# EAGLE design FD Capacitance Sensor v09 (EAGLE 9.5.2)
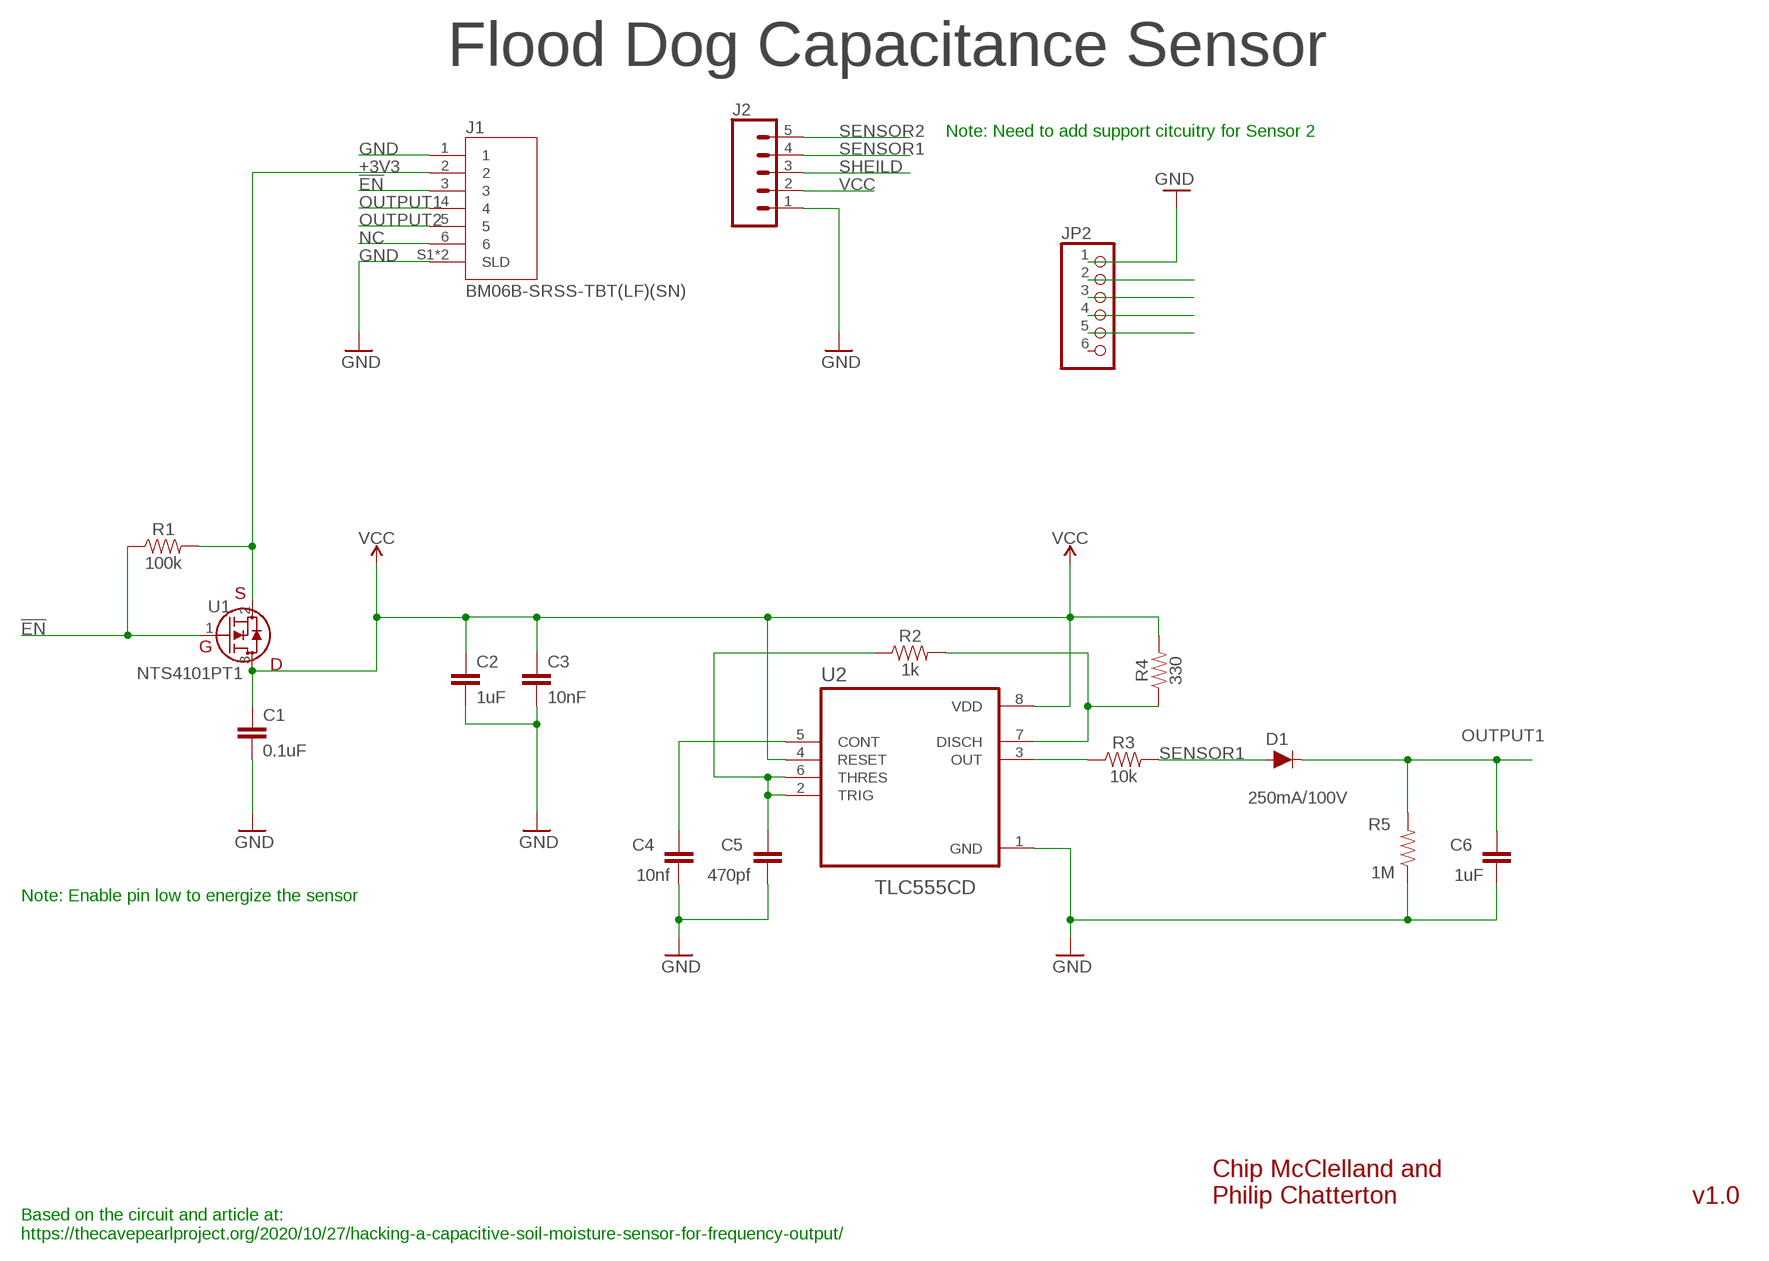
[diagram p0: schematic, sheet 1]

## Parts
C1  0.1uF  CAP-MF-0.1UF-0805  [0805@1]
C2  1uF  CAP-MF-1UF-0805  [0805@1]
C3  10nF  CAP-10NF-0805  [0805@1]
C4  10nf  C-EUC0805  [C0805]
C5  470pf  C-EUC0805  [C0805]
C6  1uF  C-EUC0805  [C0805]
D1  250mA/100V  DIODE-BAS16J  [SOD-323]
J1  BM06B-SRSS-TBT(LF)(SN)  [JST_BM06B-SRSS-TB(LF)(SN)]
J2  CONN_05SCREW  [SCREWTERMINAL-3.5MM-5]
JP2  PINHD-1X6B  [1X06-BIG]
R1  100k  RESISTOR-MF-100K-0805  [0805]
R2  1k  RESISTOR-MF-1K-0805  [0805]
R3  10k  RESISTOR-MF-10K-0805  [0805]
R4  330  RESISTOR-MF-330-0805  [0805]
R5  1M  RESISTOR-MF-1K-0805  [0805]
U1  NTS4101PT1  [SOT_101PT1_ONS]
U2  TLC555CD  [SOIC127P599X175-8N]

## Nets
!EN: J1.3 R1.1 U1.1(G)
+3V3: J1.2 R1.2 U1.2(S)
GND: C1.2 C2.2 C3.2 C4.1 C5.1 C6.1 J1.1 J1.S1(SLD) J1.S2(SLD) J2.1 JP2.1 R5.1 U2.1(GND)
N$1: C4.2 U2.5(CONT)
N$2: JP2.3
N$3: JP2.2
N$4: JP2.4
N$5: R3.1 U2.3(OUT)
N$6: JP2.5
N$8: C5.2 R2.1 U2.2(TRIG) U2.6(THRES)
N$9: R2.2 R4.1 U2.7(DISCH)
NC: J1.6
OUTPUT1: C6.2 D1.C J1.4 R5.2
OUTPUT2: J1.5
SENSOR1: D1.A J2.4 R3.2
SENSOR2: J2.5
SHEILD: J2.3
VCC [VCC]: C1.1 C2.1 C3.1 J2.2 R4.2 U1.3(D) U2.4(RESET) U2.8(VDD)
Unconnected: JP2.6

## Notes on the sheet
- Flood Dog Capacitance Sensor
- Note: Need to add support citcuitry for Sensor 2
- Note: Enable pin low to energize the sensor
- Chip McClelland and
  Philip Chatterton
- v1.0
- Based on the circuit and article at:
  https://thecavepearlproject.org/2020/10/27/hacking-a-capacitive-soil-moisture-sensor-for-frequency-output/

## Library data of the parts
C1 = Custom Components:CAP-MF-0.1UF-: Capacitor Macrofab House Part (https://factory.macrofab.com/parts). Standard ceramic capacitor, and 0.1" leaded capacitor.; HOUSEPART: YES; MPN: MF-CAP-0805-0.1uF; POPULATE: 1; URL: https://factory.macrofab.com/part/MF-CAP-0805-0.1uF
C2 = Custom Components:CAP-MF-1UF-: Capacitor Macrofab House Part (https://factory.macrofab.com/parts). Standard ceramic capacitor, and 0.1" leaded capacitor.; HOUSEPART: yes; MPN: MF-CAP-0805-1uF; POPULATE: 1; URL: https://factory.macrofab.com/part/MF-CAP-0805-1uF
C3 = Custom Components:CAP-10NF-: Capacitor 10nF variant Standard 0805 ceramic capacitor; DIGIKEY: 399-C0805X103K1RAC3316CT-ND; HOUSEPART: NO; MPN: C0805X103K1RAC3316; POPULATE: 1; URL: https://www.digikey.com/en/products/detail/kemet/C0805X103K1RAC3316/10315780
C4-C6 = rcl:C-EU: CAPACITOR, European symbol; SPICEPREFIX: C
D1 = Custom Components:DIODE: Diode These are standard reverse protection diodes and small signal diodes. SparkFun Products: SparkFun SparkPunk Sound Kit <https://www.sparkfun.com/products/11177> SparkFun ESP8266 Thing <https://www.sparkfun.com/products/13231>; MPN: BAS16HT1G
J1 = Custom Components:BM06B-SRSS-TBT(LF)(SN): 6 Position 1.0mm Top-Entry Surface Mount Shrouded Header; MPN: BM06B-SRSS-TBT(LF)(SN); POPULATE: 1
J2 = SparkFun-Connectors:CONN_05: Multi connection point. Often used as Generic Header-pin footprint for 0.1 inch spaced/style header connections On any of the 0.1 inch spaced packages, you can populate with these: Break Away Headers - Straight <https://www.sparkfun.com/products/116> (PRT-00116) Break Away Male Headers - Right Angle <https://www.sparkfun.com/products/553> (PRT-00553) Female Headers <https://www.sparkfun.com/products/115> (PRT-00115) Break Away Headers - Machine Pin <https://www.sparkfun.com/products/117> (PRT-00117) Break Away Female Headers - Swiss Machine Pin <https://www.sparkfun.com/products/743> (PRT-00743) For SCREWTERMINALS and SPRING TERMINALS visit here: Screw Terimnals on SparkFun.com <https://www.sparkfun.com/search/results?term=Screw+Terminals> (5mm/3.5mm/2.54mm spacing) This device is also useful as a general connection point to wire up your design to another part of your project. Our various solder wires solder well into these plated through hole pads. Hook-Up Wire - Assortment (Stranded, 22 AWG) <https://www.sparkfun.com/products/11375> (PRT-11375) Hook-Up Wire - Assortment (Solid Core, 22 AWG) <https://www.sparkfun.com/products/11367> (PRT-11367) View the entire wire category on our website here <https://www.sparkfun.com/categories/141> Special notes: Molex polarized connector foot print use with SKU : PRT-08231 with associated crimp pins and housings. 1MM SMD Version SKU: PRT-10208; PROD_ID: Combine 8288+8399
JP2 = adafruit:PINHD-1X6: PIN HEADER
R1 = Custom Components:RESISTOR-MF-100K-: Generic 0805 Resistor Package; MPN: MF-RES-0805-100K; POPULATE: 1; URL: https://factory.macrofab.com/part/MF-RES-0805-100K
R2 = Custom Components:RESISTOR-MF-1K-: Generic 0805 Resistor Package; HOUSEPART: YES; MPN: MF-RES-0805-1K; POPULATE: 1; URL: https://factory.macrofab.com/part/MF-RES-0805-1k
R3 = Custom Components:RESISTOR-MF-10K-: Generic 0805 Resistor Package; MPN: MF-RES-0805-10K; POPULATE: 1; URL: https://factory.macrofab.com/part/MF-RES-0805-10K
R4 = Custom Components:RESISTOR-MF-330-: Generic 0805 Resistor Package; HOUSEPART: YES; MPN: MF-RES-0805-330; POPULATE: 1
R5 = Custom Components:RESISTOR-MF-1K-: Generic 0805 Resistor Package; HOUSEPART: YES; MPN: MF-RES-0805-1K; POPULATE: 1; URL: https://factory.macrofab.com/part/MF-RES-0805-1k; VALUE: 1k
U1 = Custom Components:NTS4101PT1; DATASHEET: https://datasheet.octopart.com/NTS4101PT1-ON-Semiconductor-datasheet-139013286.pdf; MANUFACTURER_PART_NUMBER: NTS4101PT1; SOURCELIBRARY: ON_Semiconductor_2020-03-06; VENDOR: ON Semiconductor
U2 = Custom Components:TLC555CD; DESCRIPTION: 2.1-MHz, 250-A, Low-Power Timer 8-SOIC 0 to 70; DIGI-KEY_PART_NUMBER: 296-52992-ND; MF: Texas Instruments; MP: TLC555CD; PACKAGE: SOIC-8 Texas Instruments; PURCHASE-URL: https://pricing.snapeda.com/search/part/TLC555CD/?ref=eda

## Board
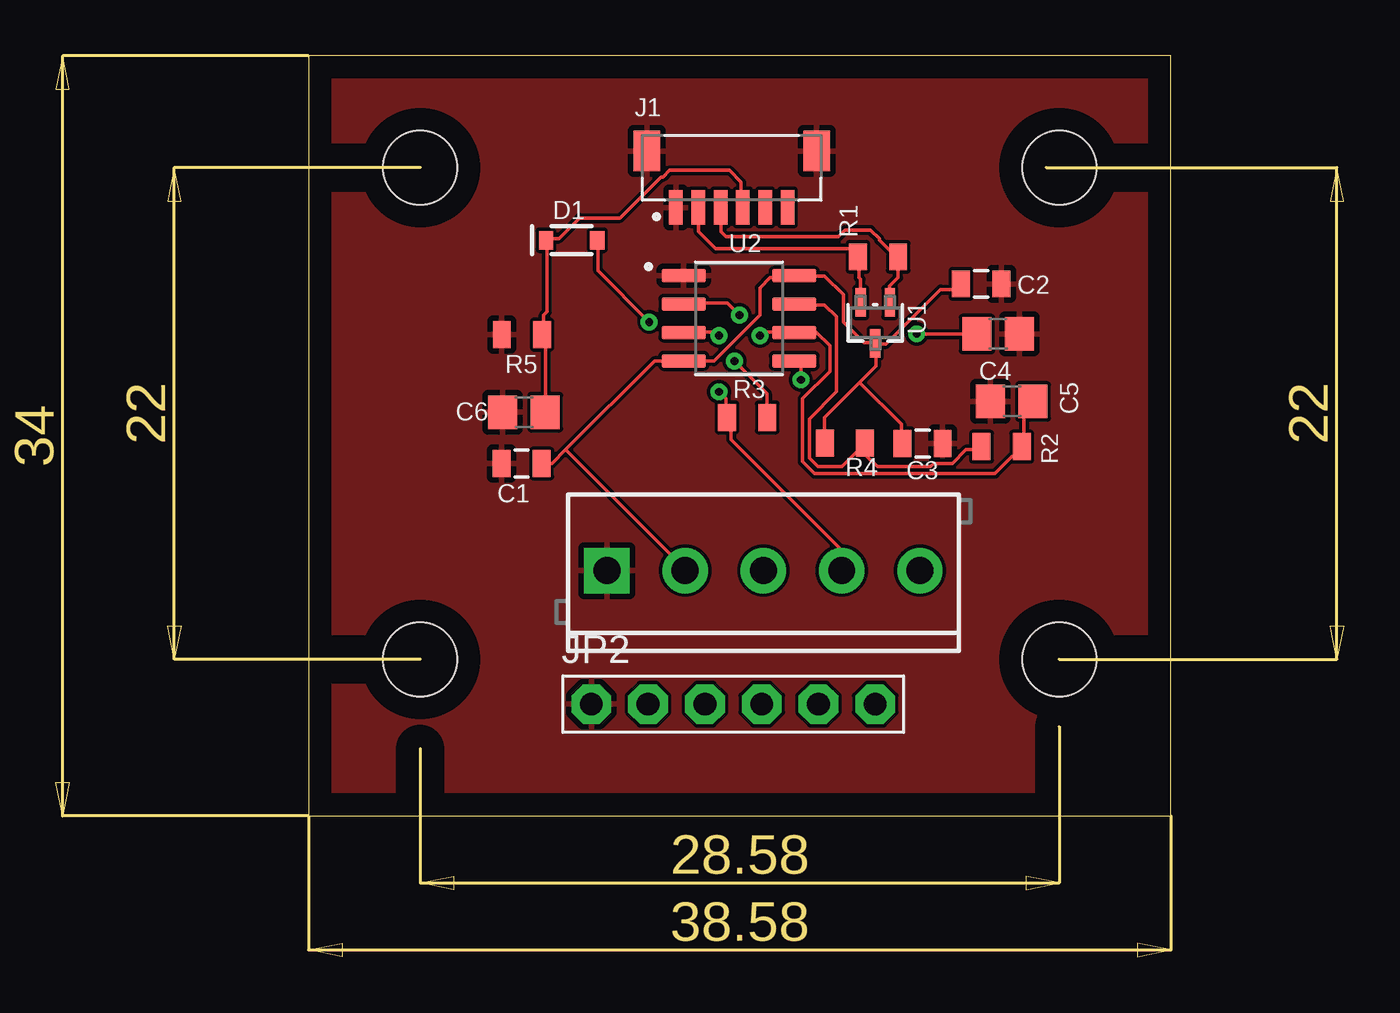
[diagram p1: board, top side]
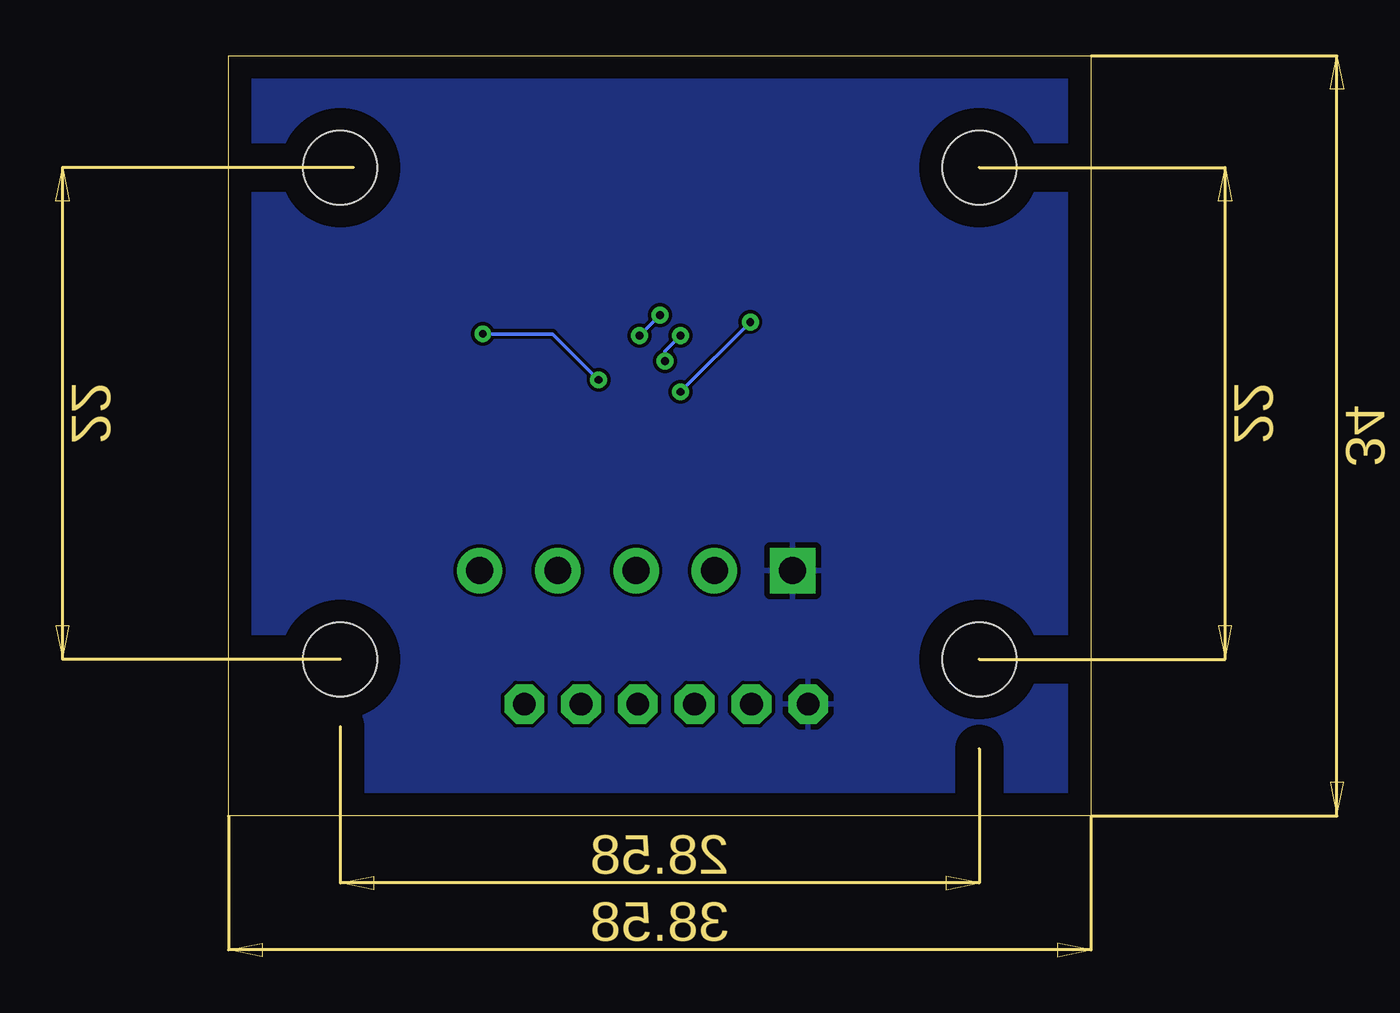
[diagram p2: board, bottom side, seen from below]

Size 38.58 x 34 mm. Coordinates in mm from the lower left corner, seen from the top.
Outline: 0,0 38.58,0 38.58,34 0,34 0,0
Copper layers (1*16): Top 0.035mm / dielectric 1.5mm / Bottom 0.035mm
Design rules "default": minimum track width 6mil, minimum drill 0.35mm, track to track 6mil, track to pad 6mil, pad to pad 6mil, via to via 6mil, smd to smd 6mil, copper to edge 40mil, drill to drill 6mil, minimum pad ring 10mil, minimum via ring 8mil, stop-mask expansion 4mil, vias tented up to drill 0mil, thermal gap 10mil

### Footprints (pad centres in the part's own frame; a part is rotated, then mirrored left to right if it is on the bottom)
0805@1 = smd 0.8 x 1.2: 1 -0.9,0; 2 0.9,0
C0805 = smd 1.3 x 1.5: 1 -0.95,0; 2 0.95,0
SOD-323 = smd 0.63 x 0.83: A 1.15,0; C -1.15,0
JST_BM06B-SRSS-TB(LF)(SN) = smd 0.6 x 1.55: 1 -2.5,-2.525; 2 -1.5,-2.525; 3 -0.5,-2.525; 4 0.5,-2.525; 5 1.5,-2.525; 6 2.5,-2.525 | smd 1.2 x 1.8: S1 -3.8,0; S2 3.8,0
SCREWTERMINAL-3.5MM-5 = drill 1.2 pad 2.032 square: 1 0,0 | drill 1.2 pad 2.032: 2 3.5,0; 3 7,0; 4 10.5,0; 5 14,0
1X06-BIG = drill 1.016 pad 1.778 octagon: 1 -6.35,0; 2 -3.81,0; 3 -1.27,0; 4 1.27,0; 5 3.81,0; 6 6.35,0
0805 = smd 0.8 x 1.2: 1 -0.9,0; 2 0.9,0
SOT_101PT1_ONS = smd 0.457 x 1.27: 1 -0.65,-0.914; 2 0.65,-0.914; 3 0,0.914
SOIC127P599X175-8N = smd 1.97 x 0.6: 1 -2.47,1.905; 2 -2.47,0.635; 3 -2.47,-0.635; 4 -2.47,-1.905; 5 2.47,-1.905; 6 2.47,-0.635; 7 2.47,0.635; 8 2.47,1.905
STAND-OFF = hole 3.302: 0,0

### Placement (x,y rotation side)
C1  9.53,15.76 180 top
C2  30.09,23.8 0 top
C3  27.46,16.67 0 top
C4  30.85,21.56 180 top
C5  31.46,18.54 0 top
C6  9.63,18.06 0 top
D1  11.77,25.76 0 top
J1  18.93,29.74 0 top
J2  13.35,10.98 0 top
JP2  19,5 0 top
R1  25.48,25.01 180 top
R2  31.01,16.52 180 top
R3  19.62,17.82 180 top
R4  24,16.68 180 top
R5  9.55,21.53 0 top
U1  25.35,22.05 180 top
U2  19.25,22.26 0 top
U$1  STAND-OFF  [STAND-OFF]  5,7 0 top
U$2  STAND-OFF  [STAND-OFF]  5,29 0 top
U$3  STAND-OFF  [STAND-OFF]  33.58,29 0 top
U$4  STAND-OFF  [STAND-OFF]  33.58,7 0 top

### Tracks (layer width: path | path; a pad name or v marks a point on that pad's centre or on a via)
!EN
  Top 0.152: U1.1 25.98,23.01 25.98,23.7 26.36,24.08 26.36,24.99 R1.1 26.29,24.99 25.53,25.76 25.53,25.83 25.15,26.21 24,26.21 23.7,25.91 18.67,25.91 18.44,26.14 18.44,27.2 J1.3
+3V3
  Top 0.152: U1.2 24.69,23.01 24.69,24 24.61,24.08 24.61,24.99 R1.2 24.54,25.07 24.23,25.38 18.21,25.38 17.45,26.14 17.45,27.2 J1.2
GND
  pour Top: -2.49,-1.97 -2.49,41.67 40.82,41.67 40.82,-1.97
  pour Bottom: -1.42,-1.13 -1.42,41.03 40.03,41.03 40.03,-1.13
N$1  (via drill 0.35)
  Top 0.152: 21.74,20.33 U2.5 21.79,20.34 22.02,20.12 v22.02,19.51 | v27.2,21.57 29.87,21.57 C4.2
  Bottom 0.152: v27.2,21.57 24.08,21.57 v22.02,19.51
N$5  (via drill 0.35)
  Top 0.152: v19.05,20.34 20.5,18.9 20.5,17.83 R3.1 | v18.36,21.49 18.21,21.64 16.84,21.64 U2.3
  Bottom 0.152: v19.05,20.34 19.05,20.8 v18.36,21.49
N$8  (via drill 0.35)
  Top 0.152: 21.59,21.55 U2.6 | C5.2 32.38,18.52 32,18.14 32,16.69 R2.1 31.85,16.38 31.55,16.08 31.47,16.08 30.71,15.32 22.63,15.32 22.1,15.85 22.1,18.67 23.32,19.89 23.32,21.03 22.71,21.64 21.79,21.64 U2.6 | v19.28,22.4 18.75,22.94 16.84,22.94 U2.2 | v20.19,21.49 20.34,21.64 21.64,21.64 U2.6
  Top 0.305: 31.98,16.59 R2.1
  Bottom 0.152: v20.19,21.49 v19.28,22.4
N$9
  Top 0.152: 21.74,22.92 U2.7 21.79,22.86 23.09,22.86 23.62,22.33 23.62,18.97 22.4,17.75 22.4,16 22.78,15.62 23.85,15.62 24.84,16.61 R4.1 24.92,16.61 24.92,16.15 25.45,15.62 27.81,15.62 27.96,15.77 28.8,15.77 29.41,16.38 30.02,16.38 30.1,16.46 R2.2
OUTPUT1
  Top 0.152: C6.2 10.59,18.14 10.59,21.57 R5.2 10.52,21.57 10.52,22.4 10.67,22.55 10.67,25.68 D1.C 10.74,25.68 10.9,25.83 11.2,25.83 12.12,26.75 13.95,26.75 15.77,28.57 15.85,28.57 16.15,28.88 18.82,28.88 19.36,28.35 19.36,27.28 J1.4
SENSOR1  (via drill 0.35)
  Top 0.152: v15.24,22.1 12.95,24.38 12.95,25.68 D1.A | v18.36,18.97 18.67,18.67 18.67,17.83 R3.2 18.75,17.75 18.9,17.6 18.9,16.84 23.77,11.96 23.77,11.05 J2.4
  Bottom 0.152: v18.36,18.97 v15.24,22.1
VCC
  Top 0.152: 29.19,23.32 C2.1 29.18,23.55 28.27,23.55 25.83,21.11 25.53,21.11 25.38,20.95 | 16.87,20.33 U2.4 | 11.51,16.38 15.47,20.34 16.76,20.34 U2.4 | 11.51,16.38 10.9,15.77 10.44,15.77 C1.1 | 11.51,16.38 16.84,11.05 J2.2 | 24.65,19.39 25.38,20.12 25.38,20.95 | 24.65,19.39 23.09,17.83 23.09,16.69 R4.2 | 25.38,20.95 25.38,21.11 U1.3 | 24.65,19.39 26.52,17.53 26.52,16.69 C3.1 | 25.38,20.95 U1.3 | U1.3 25.3,21.18 24.84,21.18 23.93,22.1 23.93,23.32 23.09,24.16 21.79,24.16 U2.8 21.79,24.08 20.65,24.08 20.19,23.62 20.19,22.4 18.14,20.34 16.92,20.34 U2.4
  Bottom 0.152: J2.2 16.88,11.01